# EAGLE design VocalVision (EAGLE 9.6.2)
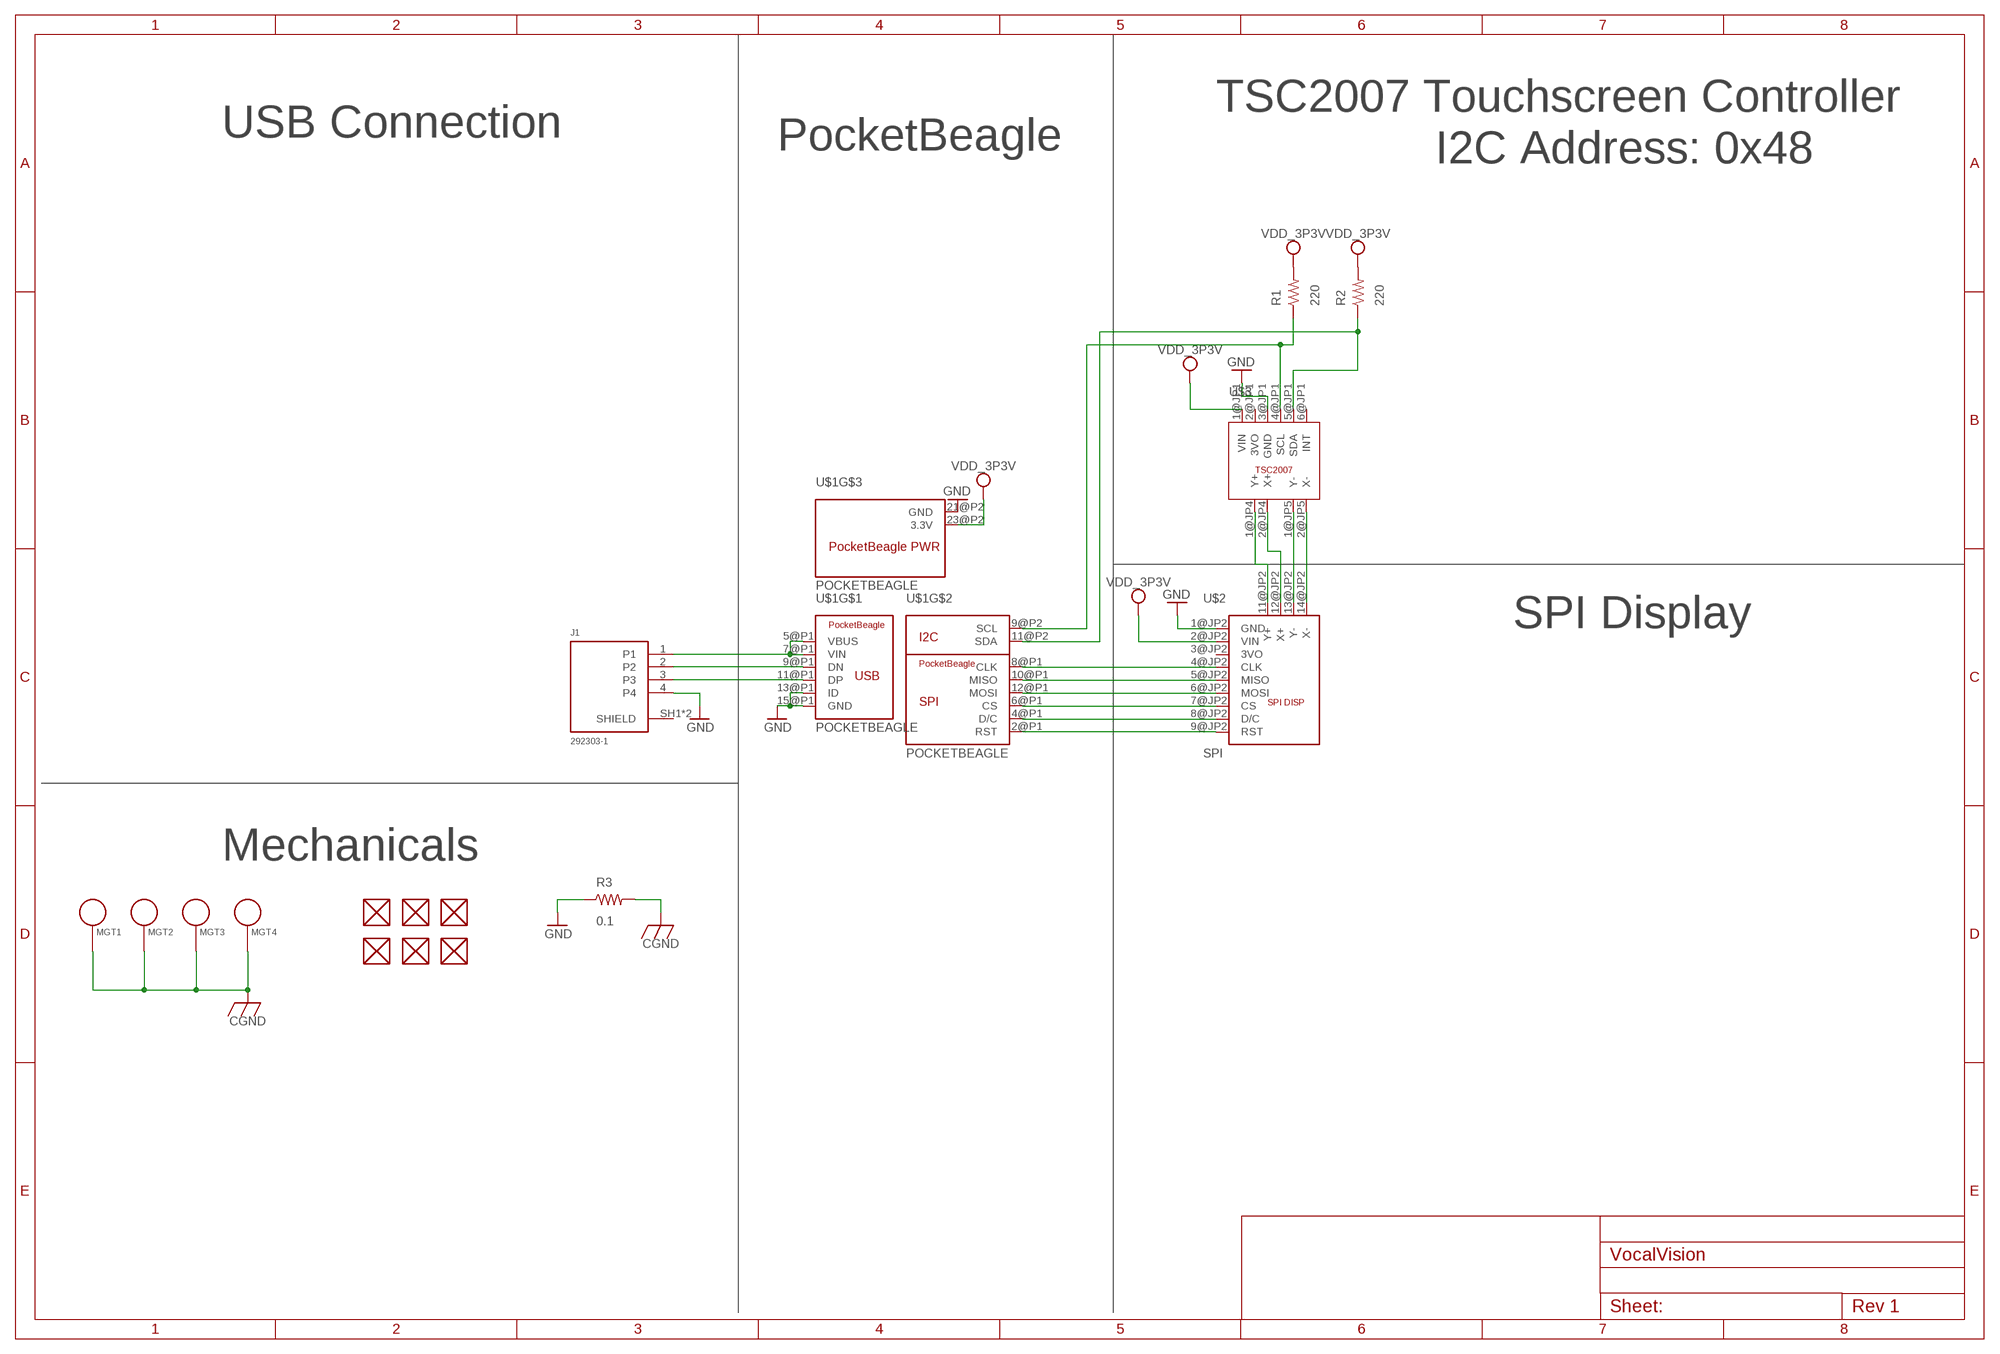
[diagram p0: schematic, sheet 1]

## Parts
FUD1  FIDUCIAL  [FIDUCIAL_40MIL]
FUD2  FIDUCIAL  [FIDUCIAL_40MIL]
FUD3  FIDUCIAL  [FIDUCIAL_40MIL]
FUD4  FIDUCIAL  [FIDUCIAL_40MIL]
FUD5  FIDUCIAL  [FIDUCIAL_40MIL]
FUD6  FIDUCIAL  [FIDUCIAL_40MIL]
J1  292303-1  [TE_292303-1]
MGT1  MOUNTING_HOLE  [MOUNTING_HOLE]
MGT2  MOUNTING_HOLE  [MOUNTING_HOLE]
MGT3  MOUNTING_HOLE  [MOUNTING_HOLE]
MGT4  MOUNTING_HOLE  [MOUNTING_HOLE]
R1  220  R_R0603  [R0603]
R2  220  R_R0603  [R0603]
R3  0.1  R_R0603  [R0603]
U$1  POCKETBEAGLE  [POCKETBEAGLE]
U$2  SPI  [SPI]
U$3  TSC2007  [TSC2007]

## Nets
CGND: MGT1.P$1 MGT2.P$1 MGT3.P$1 MGT4.P$1 R3.2
GND: J1.4 R3.1 U$1.13@P1(ID) U$1.15@P1(GND) U$1.21@P2(GND) U$2.1@JP2(GND) U$3.3@JP1(GND)
N$1: R2.1 U$1.11@P2(SDA) U$3.5@JP1(SDA)
N$2: R1.1 U$1.9@P2(SCL) U$3.4@JP1(SCL)
N$3: U$1.8@P1(CLK) U$2.4@JP2(CLK)
N$4: U$1.10@P1(MISO) U$2.5@JP2(MISO)
N$5: J1.1 U$1.5@P1(VBUS) U$1.7@P1(VIN)
N$6: J1.2 U$1.9@P1(DN)
N$7: J1.3 U$1.11@P1(DP)
N$8: U$1.12@P1(MOSI) U$2.6@JP2(MOSI)
N$9: U$1.6@P1(CS) U$2.7@JP2(CS)
N$10: U$1.4@P1(D/C) U$2.8@JP2(D/C)
N$11: U$1.2@P1(RST) U$2.9@JP2(RST)
N$14: U$2.14@JP2(X-) U$3.2@JP5(X-)
N$15: U$2.13@JP2(Y-) U$3.1@JP5(Y-)
N$16: U$2.11@JP2(Y+) U$3.1@JP4(Y+)
N$17: U$2.12@JP2(X+) U$3.2@JP4(X+)
VDD_3P3V: R1.2 R2.2 U$1.23@P2(3.3V) U$2.2@JP2(VIN) U$3.1@JP1(VIN)
Unconnected: FUD1.P$1 FUD2.P$1 FUD3.P$1 FUD4.P$1 FUD5.P$1 FUD6.P$1 J1.SH1(SHIELD) J1.SH2(SHIELD) U$2.3@JP2(3VO) U$3.2@JP1(3VO) U$3.6@JP1(INT)

## Notes on the sheet
- TSC2007 Touchscreen Controller
- USB Connection | PocketBeagle
- I2C Address: 0x48
- SPI Display
- Mechanicals

## Library data of the parts
FUD1-FUD6 = VocalVision:FIDUCIAL
J1 = VocalVision:292303-1: CONN USB RECEPT R/A TYPE A 4POS Check availability <https://pricing.snapeda.com/parts/292303-1/TE%20Connectivity/view-part?ref=eda>; AVAILABILITY: In Stock; CENTERLINE_PITCH: 2 mm[.078 in]; CHECK_PRICES: https://www.snapeda.com/parts/292303-1/TE+Connectivity+AMP+Connectors/view-part/?ref=eda; COMMENT: 292303-1; DESCRIPTION: Type A Standard USB Connector 4 Position Right Angle Mount 1 Port | TE Connectivity 292303-1; EU_ROHS_COMPLIANCE: Compliant; MF: TE Connectivity; MP: 292303-1; NUMBER_OF_POSITIONS: 4; PACKAGE: None; PRICE: None; PRODUCT_TYPE: Connector; PURCHASE-URL: https://www.snapeda.com/api/url_track_click_mouser/?unipart_id=447501&manufacturer=TE Connectivity&part_name=292303-1&search_term=292303-1; SNAPEDA_LINK: https://www.snapeda.com/parts/292303-1/TE+Connectivity+AMP+Connectors/view-part/?ref=snap
MGT1-MGT4 = VocalVision:MOUNTING_HOLE: Chassis Mounting Hole w/GND connection ability
R1-R3 = VocalVision:R_: RESISTOR, American symbol
U$1 = VocalVision:POCKETBEAGLE
U$2 = VocalVision:SPI
U$3 = VocalVision:TSC2007

## Board
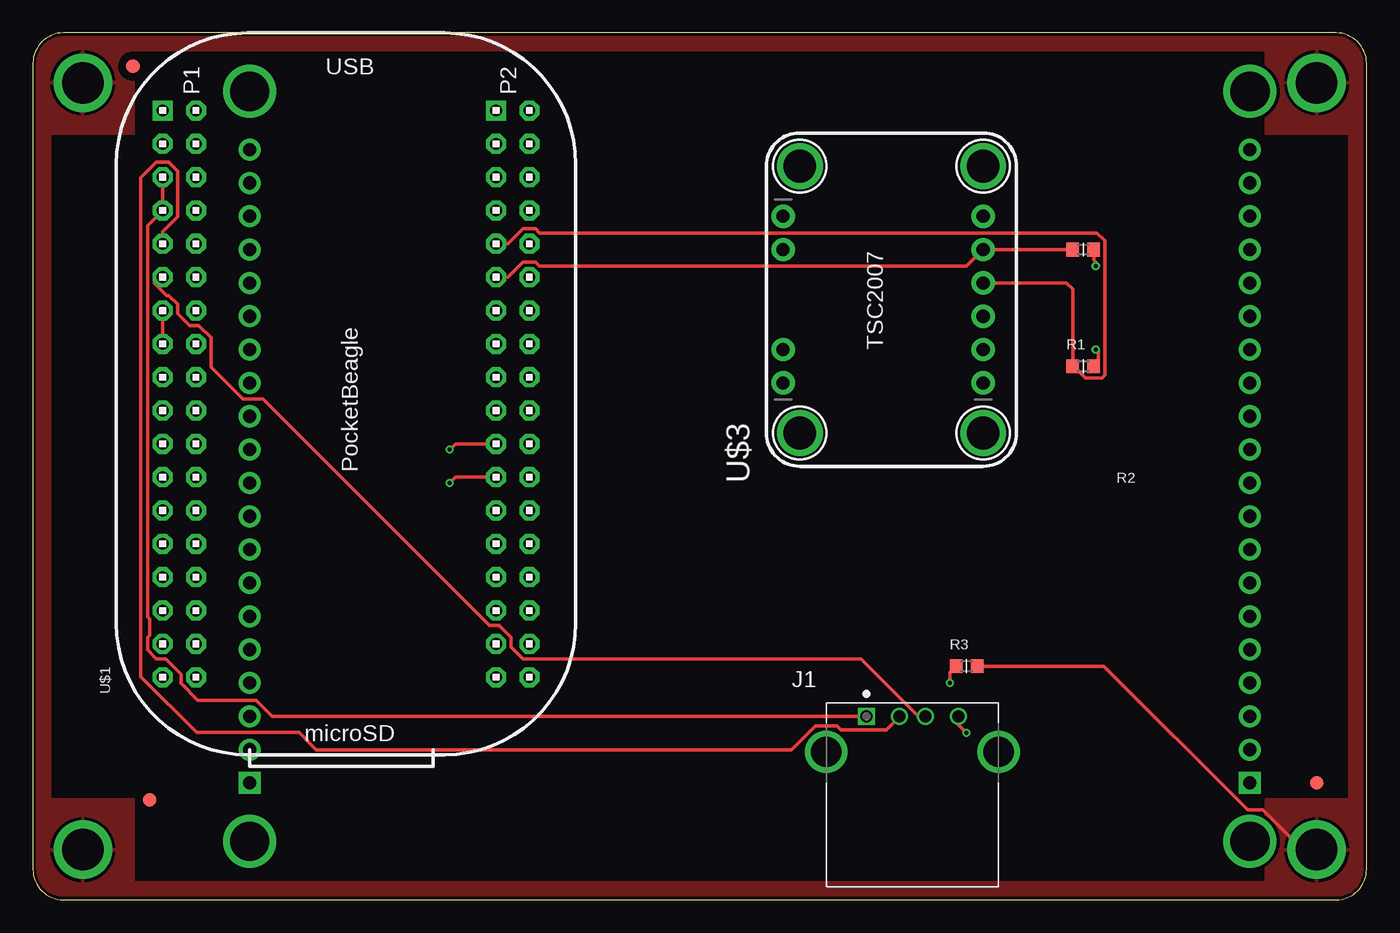
[diagram p1: board, top side]
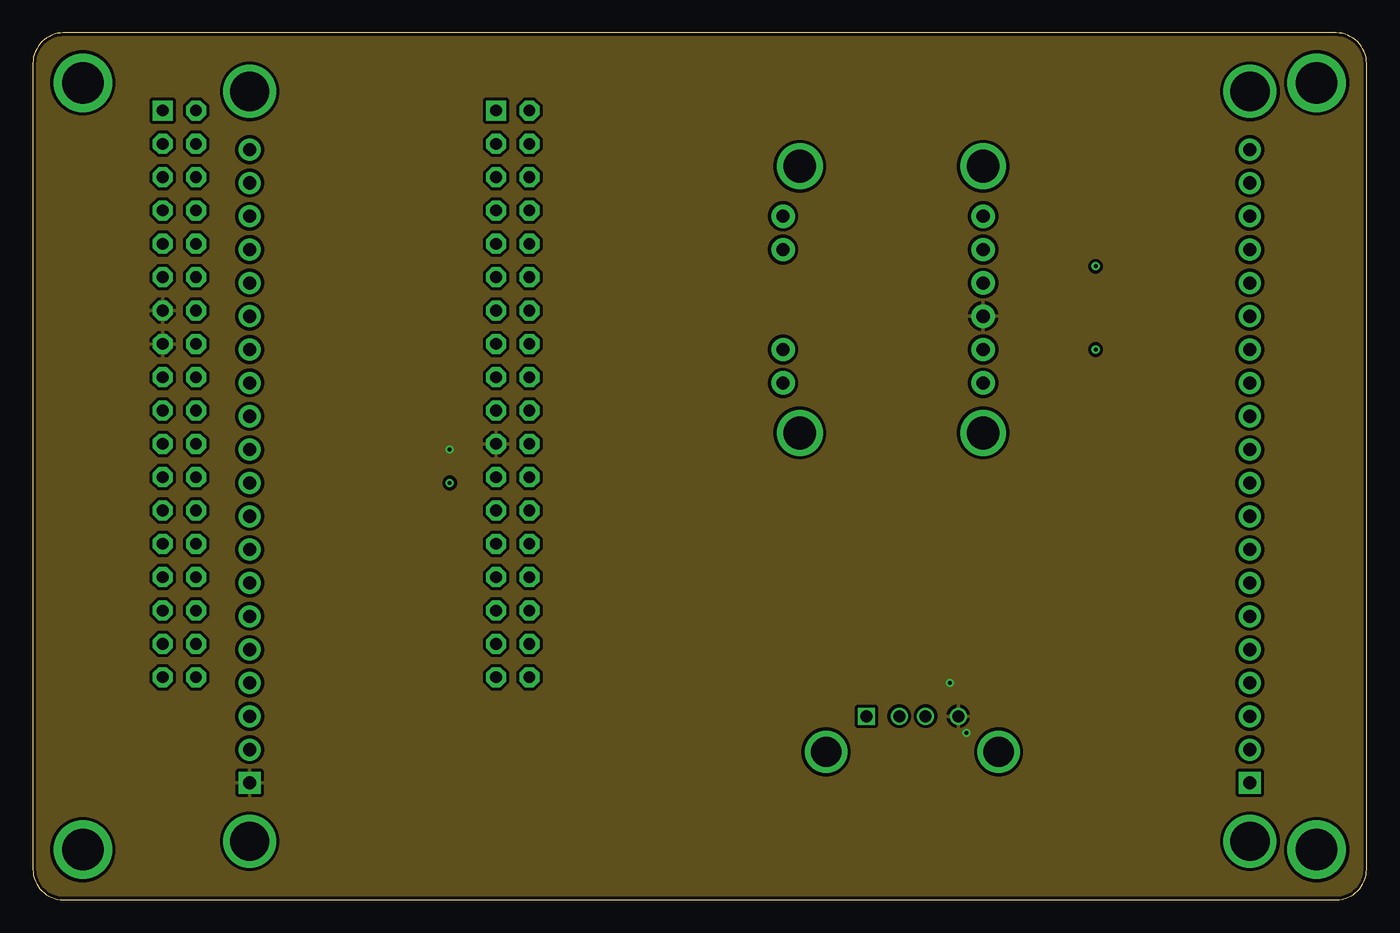
[diagram p2: board, inner layer Route2]
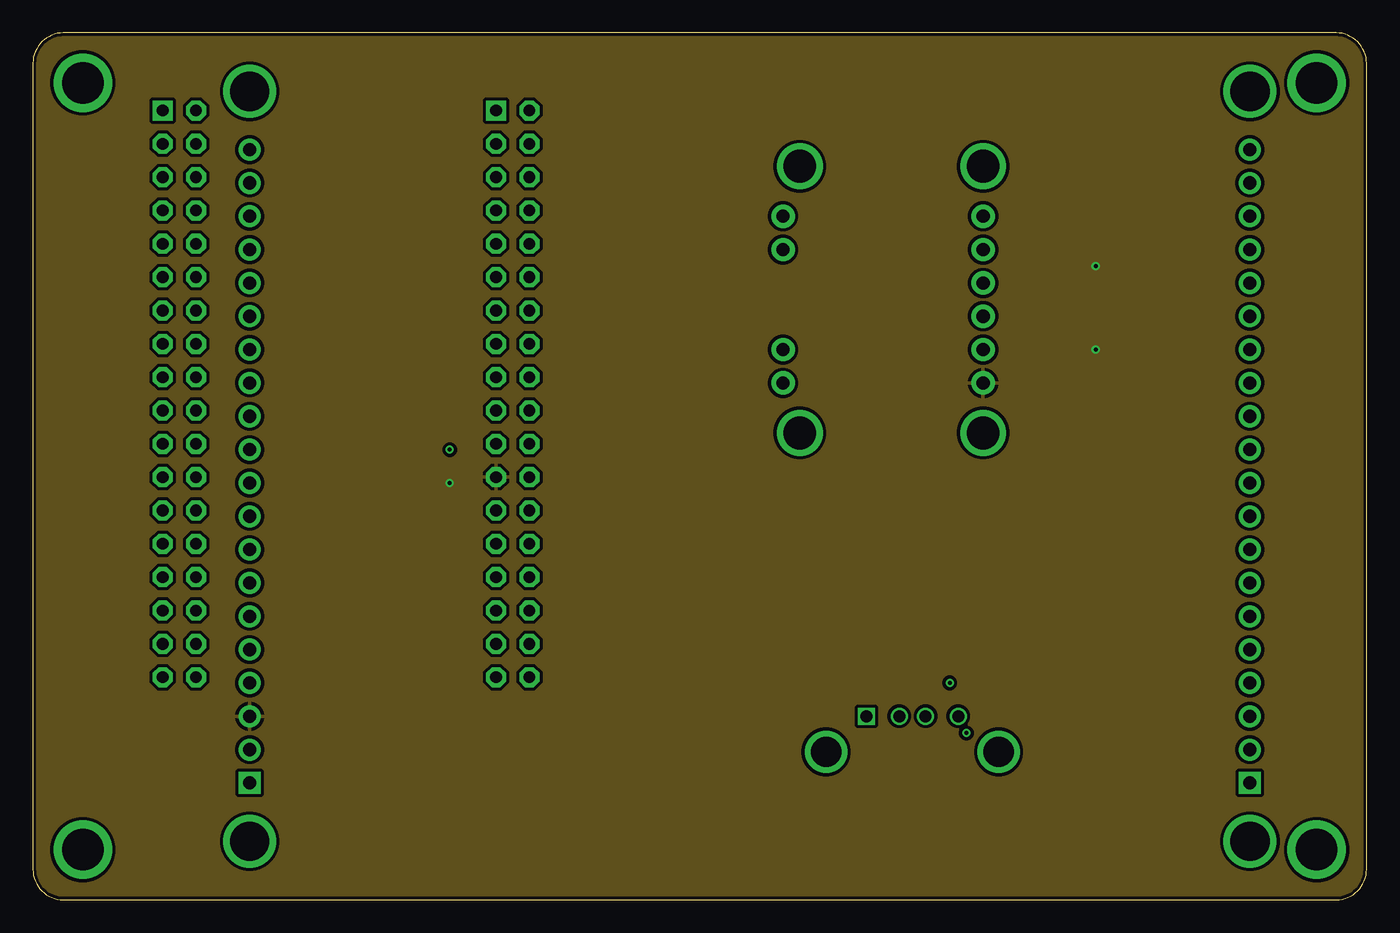
[diagram p3: board, inner layer Route15]
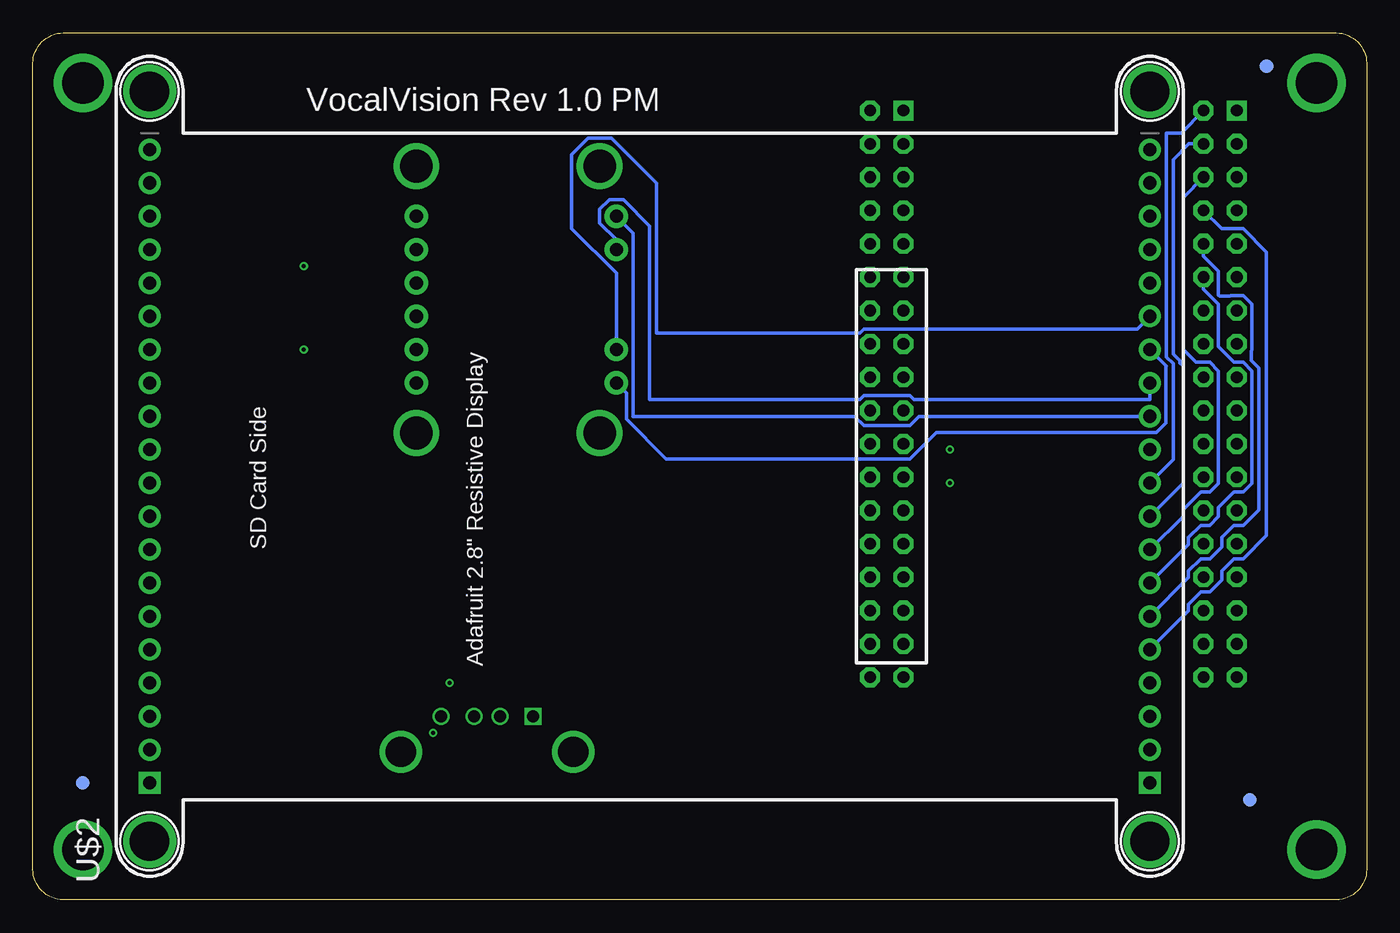
[diagram p4: board, bottom side, seen from below]

Size 101.62 x 66.06 mm. Coordinates in mm from the lower left corner, seen from the top.
Outline: 2.55,0.01 99.07,0.01 arc100 101.61,2.55 101.61,63.51 arc100 99.07,66.05 2.55,66.05 arc100 0.01,63.51 0.01,2.55 arc100 2.55,0.01
Copper layers (1*2*15*16): Top 0.035mm / dielectric 0.23mm / Route2 0.035mm / dielectric 0.93mm / Route15 0.035mm / dielectric 0.23mm / Bottom 0.035mm
Design rules "ENGI301_4lyr": minimum track width 10mil, minimum drill 12mil, track to track 10mil, track to pad 10mil, pad to pad 10mil, via to via 10mil, smd to smd 10mil, copper to edge 10mil, drill to drill 12mil, minimum pad ring 6mil, minimum via ring 6mil, stop-mask expansion 3mil, vias tented up to drill 25mil, thermal gap 10mil

### Footprints (pad centres in the part's own frame; a part is rotated, then mirrored left to right if it is on the bottom)
FIDUCIAL_40MIL = smd 1.016 x 1.016: P$1 0,0
TE_292303-1 = drill 0.92 square: 1 0,0 | drill 0.92: 2 2.5,0; 3 4.5,0; 4 7,0 | drill 2.3: SH1 -3.07,-2.71; SH2 10.07,-2.71
MOUNTING_HOLE = drill 3.175 pad 4.445: P$1 0,0
R0603 = smd 0.95 x 1.031: 1 -0.8,0; 2 0.8,0
POCKETBEAGLE = drill 0.889 pad 1.524 square: 1@P1 5.91,3.53; 1@P2 5.91,28.93 | drill 0.889 pad 1.524 octagon: 2@P1 5.91,6.07; 2@P2 5.91,31.47; 3@P1 8.45,3.53; 3@P2 8.45,28.93; 4@P1 8.45,6.07; 4@P2 8.45,31.47; 5@P1 10.99,3.53; 5@P2 10.99,28.93; 6@P1 10.99,6.07; 6@P2 10.99,31.47; 7@P1 13.53,3.53; 7@P2 13.53,28.93; 8@P1 13.53,6.07; 8@P2 13.53,31.47; 9@P1 16.07,3.53; 9@P2 16.07,28.93; 10@P1 16.07,6.07; 10@P2 16.07,31.47; 11@P1 18.61,3.53; 11@P2 18.61,28.93; 12@P1 18.61,6.07; 12@P2 18.61,31.47; 13@P1 21.15,3.53; 13@P2 21.15,28.93; 14@P1 21.15,6.07; 14@P2 21.15,31.47; 15@P1 23.69,3.53; 15@P2 23.69,28.93; 16@P1 23.69,6.07; 16@P2 23.69,31.47; 17@P1 26.23,3.53; 17@P2 26.23,28.93; 18@P1 26.23,6.07; 18@P2 26.23,31.47; 19@P1 28.77,3.53; 19@P2 28.77,28.93; 20@P1 28.77,6.07; 20@P2 28.77,31.47; 21@P1 31.31,3.53; 21@P2 31.31,28.93; 22@P1 31.31,6.07; 22@P2 31.31,31.47; 23@P1 33.85,3.53; 23@P2 33.85,28.93; 24@P1 33.85,6.07; 24@P2 33.85,31.47; 25@P1 36.39,3.53; 25@P2 36.39,28.93; 26@P1 36.39,6.07; 26@P2 36.39,31.47; 27@P1 38.93,3.53; 27@P2 38.93,28.93; 28@P1 38.93,6.07; 28@P2 38.93,31.47; 29@P1 41.47,3.53; 29@P2 41.47,28.93; 30@P1 41.47,6.07; 30@P2 41.47,31.47; 31@P1 44.01,3.53; 31@P2 44.01,28.93; 32@P1 44.01,6.07; 32@P2 44.01,31.47; 33@P1 46.55,3.53; 33@P2 46.55,28.93; 34@P1 46.55,6.07; 34@P2 46.55,31.47; 35@P1 49.09,3.53; 35@P2 49.09,28.93; 36@P1 49.09,6.07; 36@P2 49.09,31.47
SPI = drill 1 pad 1.676 square: 1@JP1 -24.13,38.1; 1@JP2 -24.13,-38.1 | drill 1 pad 1.676: 2@JP1 -21.59,38.1; 2@JP2 -19.05,-38.1; 3@JP1 -19.05,38.1; 3@JP2 -16.51,-38.1; 4@JP1 -16.51,38.1; 4@JP2 -13.97,-38.1; 5@JP1 13.97,38.1; 05@JP1 -13.97,38.1; 5@JP2 -11.43,-38.1; 6@JP1 11.43,38.1; 06@JP1 -11.43,38.1; 6@JP2 -8.89,-38.1; 7@JP1 8.89,38.1; 7@JP2 -6.35,-38.1; 8@JP1 6.35,38.1; 8@JP2 -3.81,-38.1; 9@JP1 3.81,38.1; 9@JP2 -1.27,-38.1; 10@JP1 1.27,38.1; 10@JP2 1.27,-38.1; 11@JP1 -1.27,38.1; 11@JP2 3.81,-38.1; 12@JP1 -3.81,38.1; 12@JP2 6.35,-38.1; 13@JP1 -6.35,38.1; 13@JP2 8.89,-38.1; 14@JP1 -8.89,38.1; 14@JP2 11.43,-38.1; 15@JP2 13.97,-38.1; 16@JP2 16.51,-38.1; 17@JP1 16.51,38.1; 17@JP2 19.05,-38.1; 18@JP1 19.05,38.1; 18@JP2 21.59,-38.1; 19@JP1 21.59,38.1; 19@JP2 -21.59,-38.1; 20@JP1 24.13,38.1; 20@JP2 24.13,-38.1 | drill 3 pad 3.6: P$1@U$7 -28.575,-38.1; P$1@U$15 28.575,-38.1; P$1@U$16 -28.575,38.1; P$1@U$17 28.575,38.1
TSC2007 = drill 1 pad 1.778: 1@JP1 6.35,2.54; 1@JP4 19.05,17.78; 1@JP5 6.35,17.78; 2@JP1 8.89,2.54; 2@JP4 16.51,17.78; 2@JP5 8.89,17.78; 3@JP1 11.43,2.54; 4@JP1 13.97,2.54; 5@JP1 16.51,2.54; 6@JP1 19.05,2.54 | drill 2.5 pad 3.2: P$1@U$1 2.54,16.51; P$1@U$17 22.86,16.51; P$1@U$19 2.54,2.54; P$1@U$21 22.86,2.54

### Placement (x,y rotation side)
FUD1  97.8,8.9 0 top
FUD2  7.63,63.51 0 top
FUD3  8.9,7.63 0 top
FUD4  7.63,63.51 0 bottom
FUD5  8.9,7.63 0 bottom
FUD6  97.8,8.9 90 bottom
J1  63.51,13.98 0 top
MGT1  3.82,3.82 0 top
MGT2  3.82,62.24 0 top
MGT3  97.8,62.24 0 top
MGT4  97.8,3.82 0 top
R1  80.02,40.65 0 top
R2  80.02,49.54 0 top
R3  71.13,17.79 0 top
U$1  6.36,66.05 270 top
U$2  54.62,33.03 90 bottom
U$3  74.94,33.03 90 top

### Tracks (layer width: path | path; a pad name or v marks a point on that pad's centre or on a via)
CGND
  Top 0.254: R3.2 81.61,17.79 92.56,6.84 93.71,6.84 96.73,3.82 MGT4.P$1
  pour Top: 1.28,29.22 1.28,7.63 7.63,7.63 7.63,1.28 93.99,1.28 93.99,7.63 100.34,7.63 100.34,29.22 105.42,29.22 105.42,-2.53 -2.53,-2.53 -2.53,29.22
  pour Top: 100.34,29.22 100.34,58.43 93.99,58.43 93.99,64.78 7.63,64.78 7.63,58.43 1.28,58.43 1.28,29.22 -2.53,29.22 -2.53,67.32 64.78,67.32 104.15,67.32 105.42,67.32 105.42,29.22
GND  (via drill 0.3 pad 0.61)
  Top 0.254: U$1.21@P2 32.2,34.74 v31.76,34.3 | U$1.15@P1 U$1.13@P1 | J1.4 70.51,13.33 v71.13,12.71 | R3.1 69.86,17.32 v69.86,16.52
  pour Route2: -1.26,67.32 102.88,67.32 102.88,-1.26 -1.26,-1.26
N$1
  Top 0.254: R2.1 U$3.5@JP1 71.13,48.27 38.61,48.27 38.3,48.58 37.36,48.58 36.21,47.44 U$1.11@P2
N$2
  Top 0.254: U$3.4@JP1 78.75,47 79.22,46.53 R1.1 79.29,40.65 80.19,39.75 81.45,39.75 81.67,39.98 81.67,50.21 81.08,50.81 38.61,50.81 38.3,51.12 37.36,51.12 36.21,49.98 U$1.9@P2
N$3
  Bottom 0.254: U$2.4@JP2 13.57,22.01 13.57,22.51 12.65,23.44 11.96,23.44 11.03,24.36 11.03,25.05 10.11,25.98 9.42,25.98 7.63,27.76 7.63,49.33 9.42,51.12 11.03,51.12 U$1.8@P1
N$4
  Bottom 0.254: U$2.5@JP2 13.57,24.55 13.57,25.05 12.65,25.98 11.96,25.98 11.03,26.9 11.03,27.59 10.11,28.52 9.42,28.52 8.24,29.69 8.24,40.5 8.81,41.07 8.81,41.83 8.75,41.89 8.75,45.37 9.42,46.04 10.36,46.04 10.42,45.99 11.18,45.99 11.29,46.09 11.29,47.91 12.43,49.05 U$1.10@P1
N$5
  Top 0.254: U$1.5@P1 U$1.7@P1 8.75,51.38 8.75,21.57 8.9,21.41 8.9,20.12 8.75,19.97 8.75,19.03 9.42,18.36 10.11,18.36 11.29,17.18 11.29,16.49 12.57,15.2 17.02,15.2 18.24,13.98 J1.1
N$6
  Top 0.254: U$1.9@P1 9.89,50.9 11.03,52.05 11.03,55.53 10.36,56.2 9.42,56.2 8.24,55.02 8.24,16.99 12.47,12.76 20.28,12.76 21.6,11.44 57.79,11.44 59.61,13.26 61.26,13.26 61.57,12.95 65.02,12.95 66.05,13.98 J1.2
N$7
  Top 0.254: J1.3 67.46,13.98 63.08,18.36 37.36,18.36 36.43,19.28 36.43,19.97 35.51,20.9 34.82,20.9 17.55,38.16 16.01,38.16 13.57,40.6 13.57,42.83 12.65,43.76 11.96,43.76 11.03,44.68 11.03,45.37 10.36,46.04 10.21,46.04 9.25,47 9.69,47.44 U$1.11@P1
N$8
  Bottom 0.254: U$2.6@JP2 13.57,27.09 13.57,27.59 12.65,28.52 11.96,28.52 11.29,29.19 11.29,29.88 10.11,31.06 9.42,31.06 8.75,31.73 8.75,40.29 9.42,40.96 10.11,40.96 11.29,42.14 11.29,45.37 12.43,46.51 U$1.12@P1
N$9
  Bottom 0.254: U$1.6@P1 13.98,53.51 13.98,41.92 13.02,40.96 11.96,40.96 11.29,40.29 11.29,31.73 11.96,31.06 12.65,31.06 13.98,29.72 13.98,29.22 U$2.7@JP2
N$10
  Bottom 0.254: U$1.4@P1 13.54,57.6 14.74,56.4 14.74,41.58 14.23,41.07 14.23,40.9 13.98,40.65 13.98,31.76 U$2.8@JP2
N$11
  Bottom 0.254: U$1.2@P1 14.14,58.43 15.25,58.43 15.25,41.37 14.74,40.86 14.74,33.54 U$2.9@JP2
N$14
  Bottom 0.254: U$3.2@JP5 57.16,47.74 60.57,51.16 60.57,56.78 59.32,58.03 57.54,58.03 54.11,54.6 54.11,43.19 38.61,43.19 38.3,43.5 17.48,43.5 U$2.14@JP2
N$15
  Bottom 0.254: U$3.1@JP5 56.4,38.62 56.4,36.63 53.36,33.6 34.82,33.6 32.79,35.62 16.01,35.62 15.3,36.33 15.3,40.6 15.25,40.65 U$2.13@JP2
N$16
  Bottom 0.254: U$3.1@JP4 55.89,50.81 55.89,36.84 39,36.84 38.3,36.14 34.82,36.14 34.11,36.84 U$2.11@JP2
N$17
  Bottom 0.254: U$3.2@JP4 57.16,50.28 58.43,51.55 58.43,52.6 57.68,53.35 56.63,53.35 54.62,51.33 54.62,38.11 38.61,38.11 38.3,38.42 34.82,38.42 34.5,38.11 16.52,38.11 U$2.12@JP2
VDD_3P3V  (via drill 0.3 pad 0.61)
  Top 0.254: U$1.23@P2 32.2,32.2 v31.76,31.76 | R2.2 80.82,48.74 81.17,48.39 81.17,48.27 v80.97,48.27 | R1.2 81.17,41 81.17,41.92 v80.97,41.92
  pour Route15: -5.07,71.13 106.69,71.13 106.69,-3.8 -5.07,-3.8

### Text on the board
bPlace: VocalVision Rev 1.0 PM